# EAGLE design SPDT_eval_R2 (EAGLE 8.5.1)
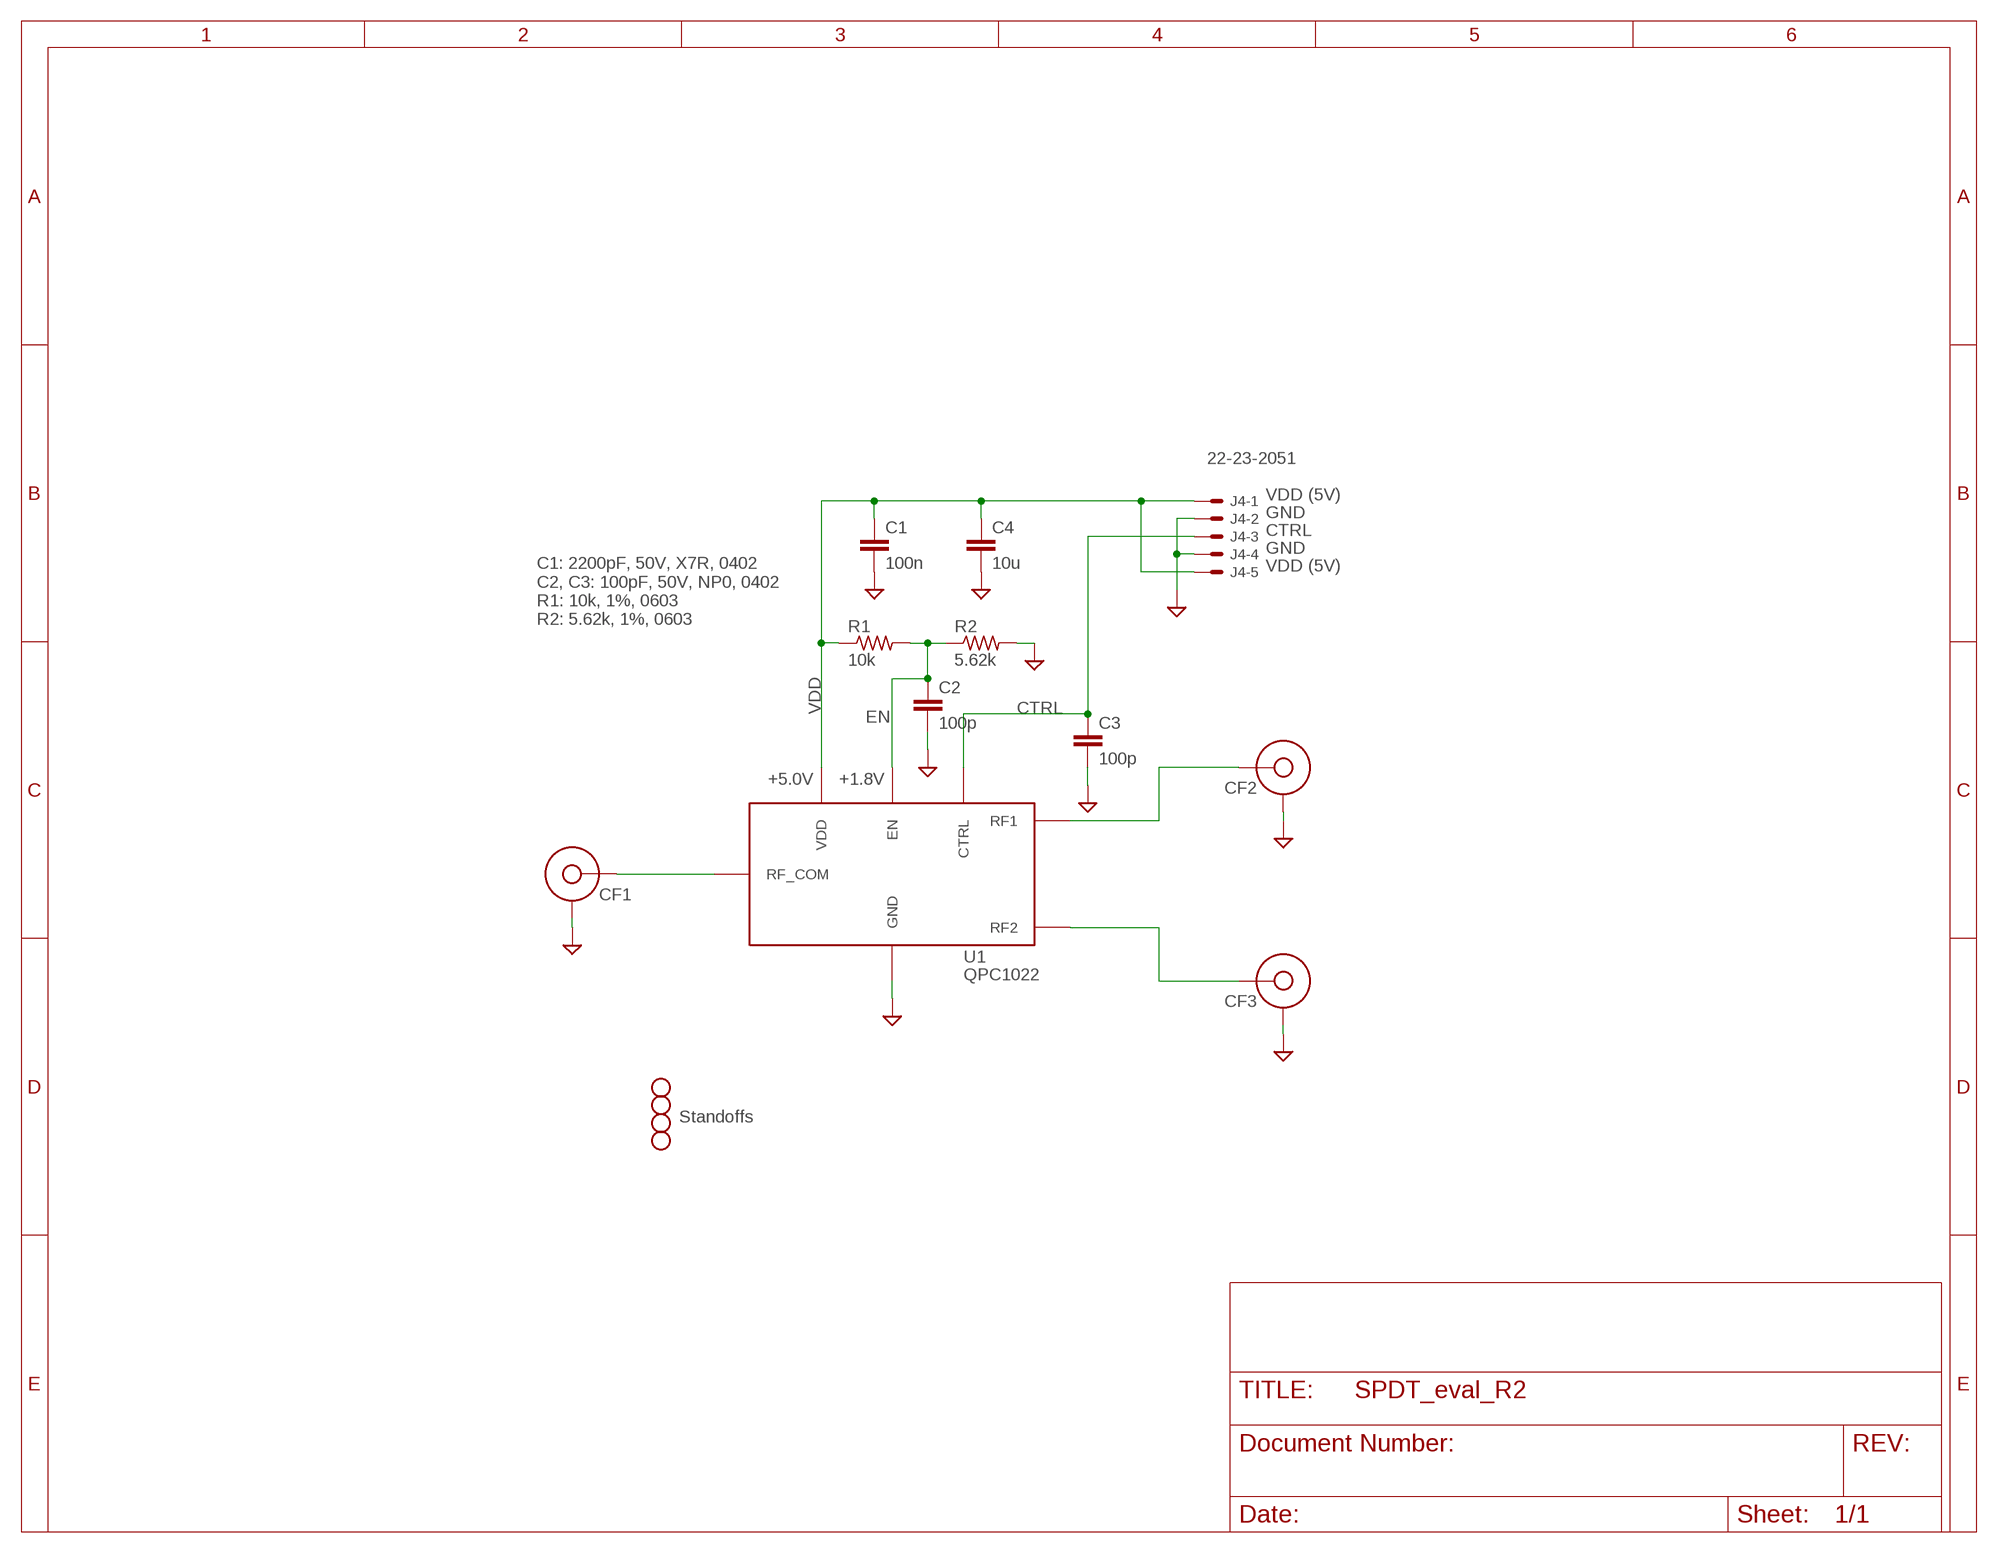
[diagram p0: schematic, sheet 1]

## Parts
C1  100n  C-EU0402-B-NOSILK  [.0402-B-NOSILK]
C2  100p  C-EU0402-B-NOSILK  [.0402-B-NOSILK]
C3  100p  C-EU0402-B-NOSILK  [.0402-B-NOSILK]
C4  10u  C-EU0805-B-NOSILK  [.0805-B-NOSILK]
CF1  SMA-CINCH-END-FIRE  [SMAJ716-ND]
CF2  SMA-CINCH-END-FIRE  [SMAJ716-ND]
CF3  SMA-CINCH-END-FIRE  [SMAJ716-ND]
H1  STAND-OFFTIGHT  [STAND-OFF-TIGHT]
H2  STAND-OFFTIGHT  [STAND-OFF-TIGHT]
H3  STAND-OFFTIGHT  [STAND-OFF-TIGHT]
H4  STAND-OFFTIGHT  [STAND-OFF-TIGHT]
J4  22-23-2051  [22-23-2051]
R1  10k  R-US_0603-B-NOSILK  [.0603-B-NOSILK]
R2  5.62k  R-US_0603-B-NOSILK  [.0603-B-NOSILK]
U1  QPC1022  [QPC1022]

## Nets
COM [RF]: CF1.P$3(CENTERCONDUCTOR) U1.ANT(RF_COM)
CTRL: C3.1 J4.3 U1.CTRL
EN: C2.1 R1.2 R2.1 U1.EN
GND: C1.2 C2.2 C3.2 C4.2 CF1.GND1(GND) CF1.GND2(GND) CF1.GND3(GND) CF1.GND4(GND) CF2.GND1(GND) CF2.GND2(GND) CF2.GND3(GND) CF2.GND4(GND) CF3.GND1(GND) CF3.GND2(GND) CF3.GND3(GND) CF3.GND4(GND) J4.2 J4.4 R2.2 U1.GND@1(GND) U1.GND@2(GND) U1.GND@3(GND)
RF1 [RF]: CF2.P$3(CENTERCONDUCTOR) U1.RF1
RF2 [RF]: CF3.P$3(CENTERCONDUCTOR) U1.RF2
VDD: C1.1 C4.1 J4.1 J4.5 R1.1 U1.VDD

## Notes on the sheet
- VDD (5V)
- GND
- CTRL
- GND
- VDD (5V)
- C1: 2200pF, 50V, X7R, 0402
  C2, C3: 100pF, 50V, NP0, 0402
  R1: 10k, 1%, 0603
  R2: 5.62k, 1%, 0603
- +5.0V | +1.8V
- Standoffs

## Library data of the parts
C1-C4 = rcl_custom:C-EU: CAPACITOR, European symbol
CF1-CF3 = psas_c3_team05:SMA-CINCH-END-FIRE
H1-H4 = SparkFun-Hardware:STAND-OFF: Stand Off Drill holes for mechanically mounting via screws, standoffs, etc. Note: Use the keepout ring to avoid running the screw head into surrounding components. Variant Overviews STAND-OFF - Mechanical footprint for a #4 phillips button head screw. STAND-OFF-TIGHT - Mechanical footprint for a #4 phillips button head screw, Example SparkFun Products Screw - Phillips Head (1/4", 4-40, 10 pack) <https://www.sparkfun.com/products/10453> (PRT-10453) Screw - Phillips Head (1/2", 4-40, 10 pack) <https://www.sparkfun.com/products/10452> (PRT-10452) Screw - Phillips Head (3/4", 4-40, 10 pack) <https://www.sparkfun.com/products/10451> (PRT-10451) Screw - Phillips Head (1", 4-40, 10 pack) <https://www.sparkfun.com/products/10450> (PRT-10450)
J4 = con-molex:22-23-2051: .100" (2.54mm) Center Header - 5 Pin; MF: MOLEX; MPN: 22-23-2051; OC_FARNELL: 1462952; OC_NEWARK: 38C9178
R1 R2 = rcl_custom:R-US_: RESISTOR, American symbol
U1 = QPC1022:QPC1022

## Net classes
1 RF: width 0.33 mm, clearance 0.34 mm

## Board
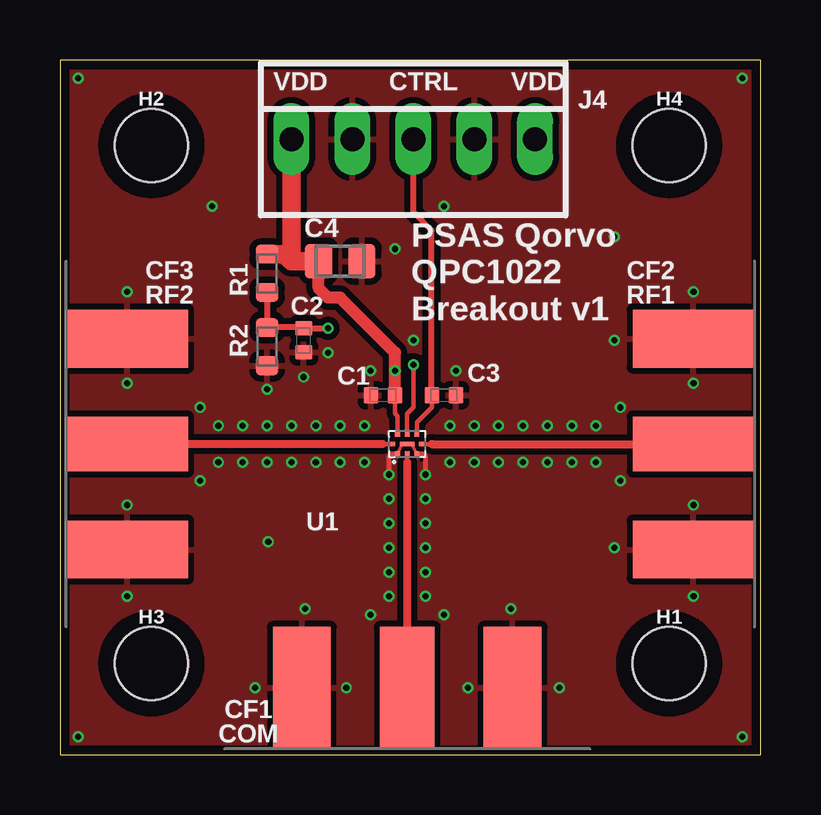
[diagram p1: board, top side]
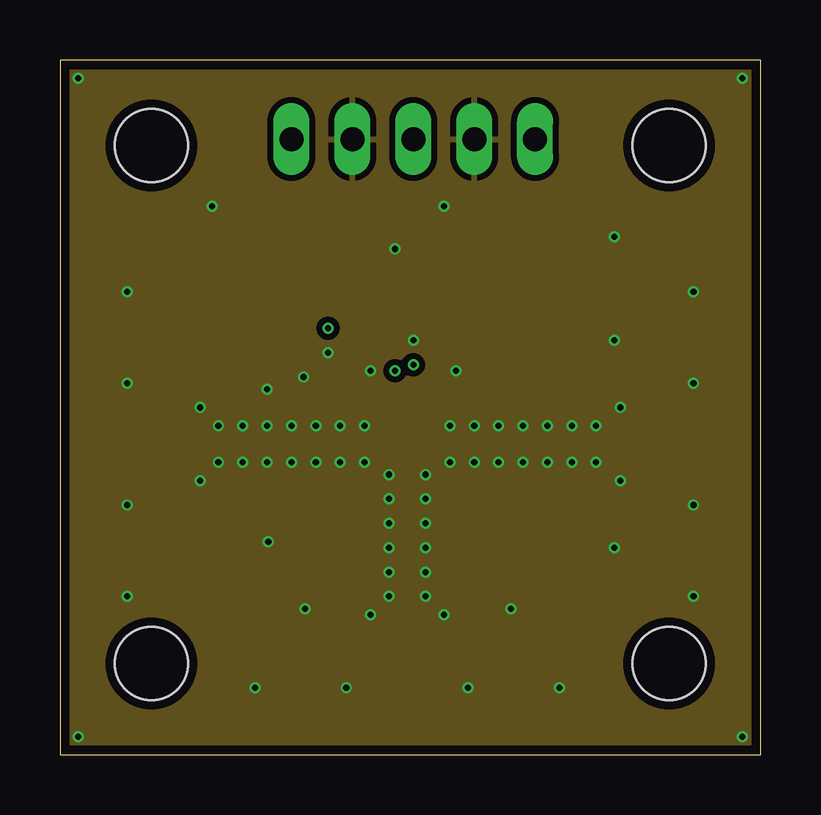
[diagram p2: board, inner layer Route2]
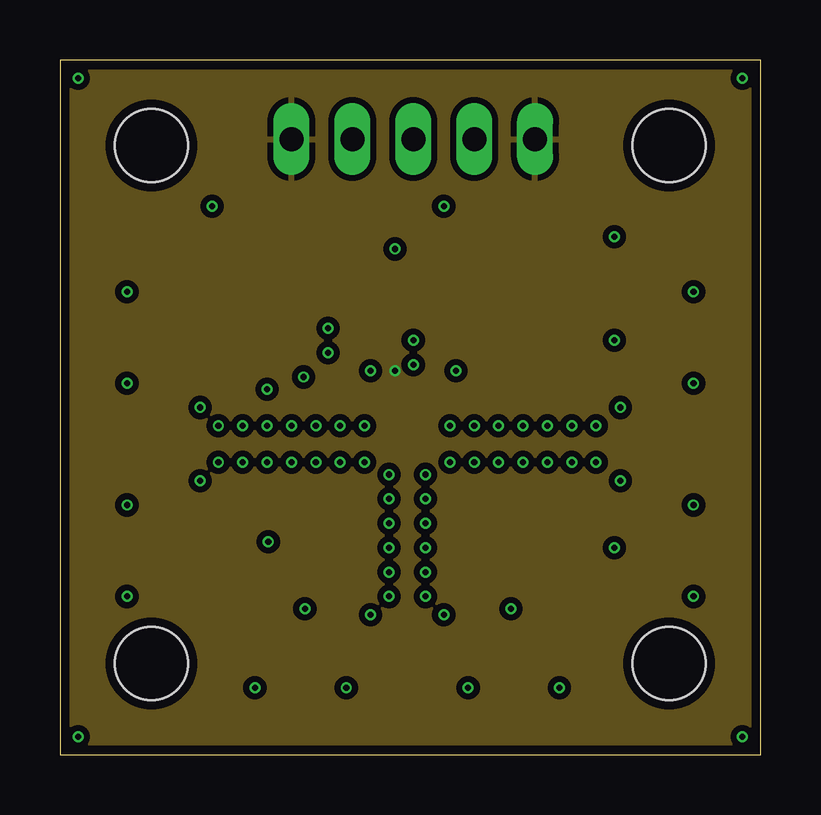
[diagram p3: board, inner layer Route15]
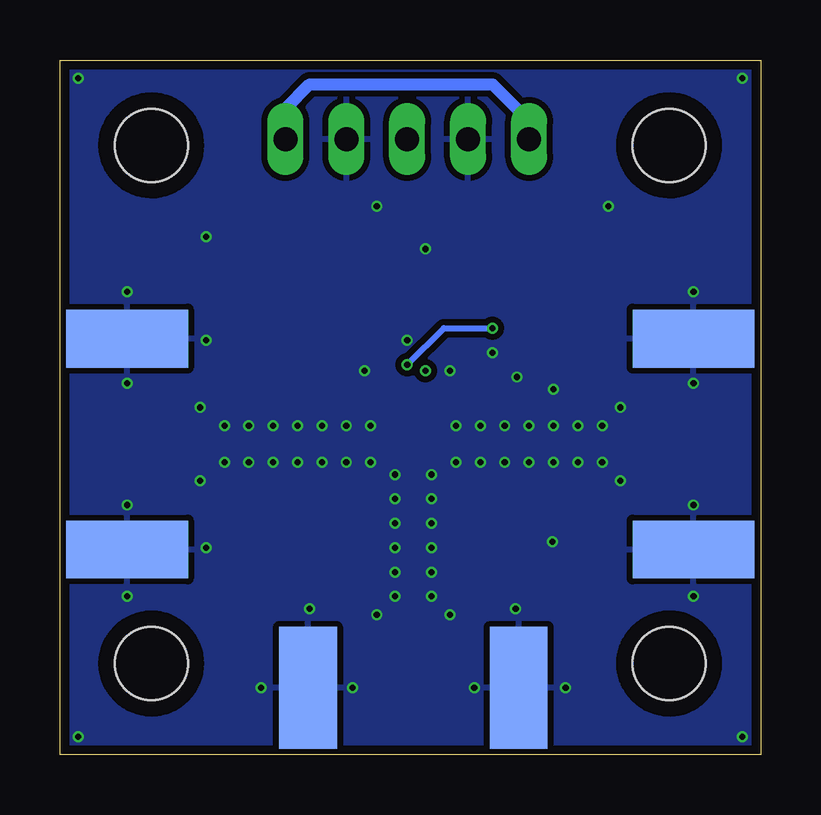
[diagram p4: board, bottom side, seen from below]

Size 29.21 x 28.96 mm. Coordinates in mm from the lower left corner, seen from the top.
Outline: 0,0 29.21,0 29.21,28.96 0,28.96 0,0
Copper layers (1*2*15*16): Top 0.035559375mm / dielectric 0.17018125mm / Route2 0.01778125mm / dielectric 47mil / Route15 0.01778125mm / dielectric 0.17018125mm / Bottom 0.035559375mm
Design rules "oshpark-4layer": minimum track width 5mil, minimum drill 10mil, track to track 5mil, track to pad 5mil, pad to pad 5mil, via to via 5mil, smd to smd 5mil, copper to edge 15mil, drill to drill 6mil, minimum pad ring 4mil, minimum via ring 4mil, stop-mask expansion 2.5mil, vias tented up to drill 0mil, thermal gap 10mil

### Footprints (pad centres in the part's own frame; a part is rotated, then mirrored left to right if it is on the bottom)
.0402-B-NOSILK = smd 0.6 x 0.7: 1 -0.5,0; 2 0.5,0
.0805-B-NOSILK = smd 1.15 x 1.45: 1 -0.9,0; 2 0.9,0
SMAJ716-ND = smd 2.413 x 5.08 bottom: GND1 4.394,0; GND3 -4.394,0 | smd 2.413 x 5.08: GND2 -4.394,0; GND4 4.394,0 | smd 2.286 x 5.08: P$3 0,0
STAND-OFF-TIGHT = hole 3.048: 0,0
22-23-2051 = drill 1 long: 1 -5.08,0; 2 -2.54,0; 3 0,0; 4 2.54,0; 5 5.08,0
.0603-B-NOSILK = smd 0.8 x 0.95: 1 -0.8,0; 2 0.8,0
QPC1022 = smd 0.2 x 0.2: ANT -0.4,0; CTRL 0.4,-0.4; EN 0.4,0; GND@1 -0.4,0.4; GND@2 -0.4,-0.4; RF1 0,-0.6; RF2 0,0.6; VDD 0.4,0.4 | smd 0.2 x 0.6: GND@3 0,0

### Placement (x,y rotation side)
C1  13.46,14.99 180 top
C2  10.16,17.27 270 top
C3  16,14.99 0 top
C4  11.68,20.57 0 top
CF1  14.48,2.79 180 top
CF2  26.42,12.95 270 top
CF3  2.79,12.95 90 top
H1  25.4,3.81 0 top
H2  3.81,25.4 0 top
H3  3.81,3.81 0 top
H4  25.4,25.4 0 top
J4  14.73,25.65 0 top
R1  8.64,20.07 270 top
R2  8.64,17.02 270 top
U1  14.48,12.95 90 top

### Tracks (layer width: path | path; a pad name or v marks a point on that pad's centre or on a via)
COM
  Top 0.178: U1.ANT 14.48,12.19
  Top 0.33: 14.48,12.19 CF1.P$3
CTRL
  Top 0.178: U1.CTRL 14.88,13.86 15.5,14.49 C3.1
  Top 0.254: C3.1 15.49,21.84 14.73,22.61 J4.3
EN  (via drill 0.25)
  Top 0.178: U1.EN 14.48,14.22 14.73,14.48 v14.73,16.26
  Top 0.254: R1.2 R2.1 9.95,17.82 C2.1 10,17.78 v11.18,17.78
  Bottom 0.254: v14.73,16.26 13.21,17.78 v11.18,17.78
GND  (via drill 0.25)
  Top 0.127: U1.GND@1 14.28,12.95 | U1.GND@2 14.68,12.95
  Top 0.152: 14.28,12.95 U1.GND@3 14.68,12.95
  Top 0.178: U1.GND@1 13.82,12.55 13.72,12.45 v13.72,11.68 | U1.GND@2 15.13,12.55 15.24,12.45 v15.24,11.68
  other vias: 2.79,19.3 18.8,6.1 10.21,6.1 11.68,13.72 16.26,13.72 10.16,15.75 8.64,15.24 0.76,28.19 28.45,28.19 28.45,0.76 0.76,0.76 2.79,6.6 2.79,15.49 2.79,10.41 8.13,2.79 11.94,2.79 17.02,2.79 20.83,2.79 26.42,6.6 26.42,10.41 26.42,15.49 26.42,19.3 8.69,8.89 23.11,17.27 23.11,8.64 10.67,13.72 9.65,13.72 8.64,13.72 17.27,13.72 18.29,13.72 17.27,12.19 16.26,12.19 15.24,10.67 11.68,12.19 10.67,12.19 9.65,12.19 13.72,9.65 13.72,8.64 15.24,9.65 15.24,8.64 16.51,16 14.73,17.27 12.95,16 11.18,16.76 13.97,21.08 6.35,22.86 23.11,21.59 16,22.86 13.72,10.67 8.64,12.19 12.7,12.19 18.29,12.19 19.3,12.19 20.32,12.19 19.3,13.72 20.32,13.72 12.7,13.72 21.34,12.19 22.35,12.19 21.34,13.72 22.35,13.72 23.37,11.43 23.37,14.48 13.72,7.62 13.72,6.6 15.24,7.62 15.24,6.6 12.95,5.84 16,5.84 7.62,13.72 6.6,13.72 7.62,12.19 6.6,12.19 5.84,14.48 5.84,11.43
  pour Top (isolate 0.254): 0,28.96 29.21,28.96 29.21,0 0,0
  pour Bottom (isolate 0.254): 0,28.96 29.21,28.96 29.21,0 0,0
  pour Route2 (isolate 0.254): 0,28.96 29.21,28.96 29.21,0 0,0
RF1
  Top 0.178: U1.RF1 15.49,12.95
  Top 0.33: 15.49,12.95 CF2.P$3
RF2
  Top 0.178: U1.RF2 13.46,12.95
  Top 0.33: 13.46,12.95 CF3.P$3
VDD  (via drill 0.25)
  Top 0.178: U1.VDD 14.08,14.12 13.96,14.23 C1.1
  Top 0.508: C1.1 v13.96,15.99 v13.97,16 13.97,16.76 11.68,19.05 11.18,19.05 10.78,19.44 C4.1
  Top 0.762: C4.1 9.65,20.57 | 9.65,20.57 J4.1 | R1.1 9.36,20.87 9.65,20.57
  Bottom 0.508: J4.5 19.81,26.92 18.8,27.94 11.18,27.94 9.65,26.42 J4.1
  pour Route15 (isolate 0.254): 0,28.96 29.21,28.96 29.21,0 0,0

### Text on the board
tPlace: VDD | CTRL | VDD | RF2 | RF1 | PSAS Qorvo / QPC1022 / Breakout v1 | COM